# EAGLE design FLEXQCMV1.5 (EAGLE 7.2.0)
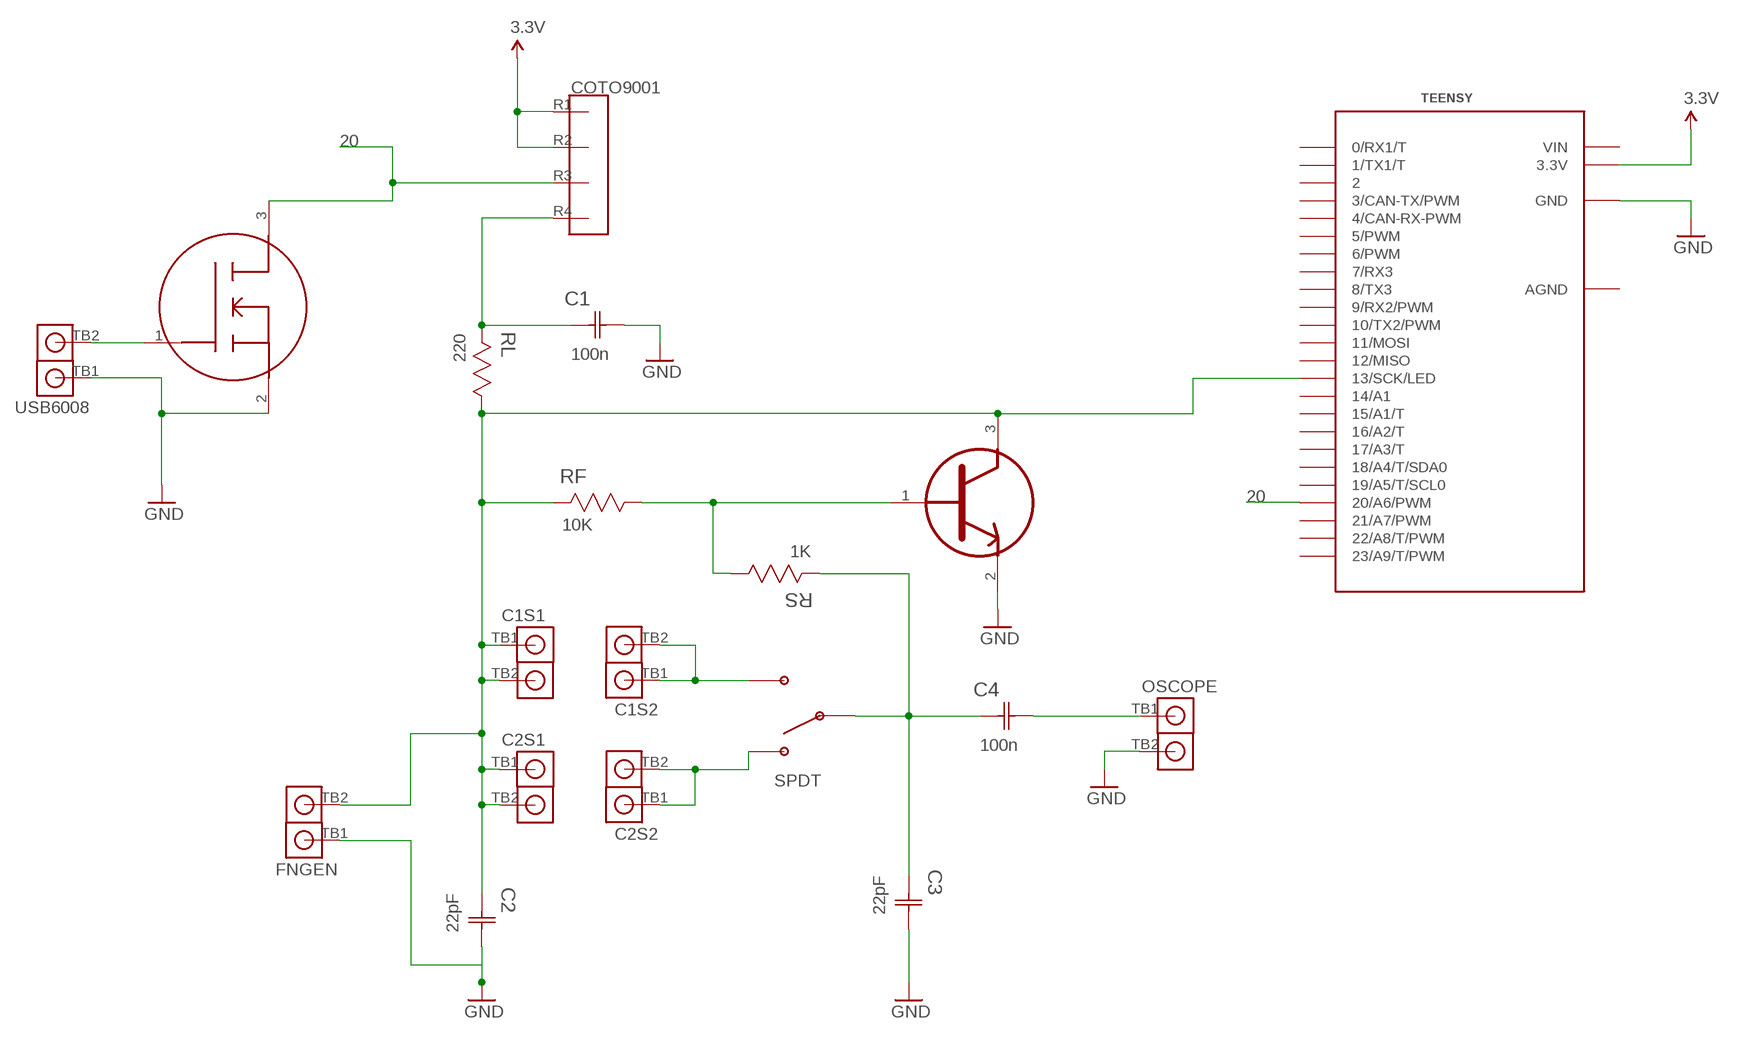
[diagram p0: schematic, sheet 1]

## Parts
C1  100n  C1206C104K1RACTU  [CAPC3216X88N]
C1S1  TERMBLOCKX2  [TERMBLOCKX2]
C1S2  TERMBLOCKX2  [TERMBLOCKX2]
C2  22pF  C1206C220J5GACTU  [CAPC3216X88N]
C2S1  TERMBLOCKX2  [TERMBLOCKX2]
C2S2  TERMBLOCKX2  [TERMBLOCKX2]
C3  22pF  C1206C220J5GACTU  [CAPC3216X88N]
C4  100n  C1206C104K1RACTU  [CAPC3216X88N]
COTO9001  COTO9001  [COTO9001]
FNGEN  TERMBLOCKX2  [TERMBLOCKX2]
OSCOPE  TERMBLOCKX2  [TERMBLOCKX2]
RF  10K  CRCW120610K0FKEA  [RESC3216X71N]
RL  220  CRCW1206220RJNEA  [RESC3216X71N]
RS  1K  CRCW12061K00FKEA  [RESC3216X71N]
SPDT  SPDTSWITCH  [SPDTSWITCH]
TEENSY  TEENSY_3.1_DIL  [TEENSY3-DIL]
U1  FET  2N7002K  [SOT95P230X110-3N]
U2  BJT  BC847C  [SOT95P230X110-3N]
USB6008  TERMBLOCKX2  [TERMBLOCKX2]

## Nets
3.3V: COTO9001.R1 COTO9001.R2 TEENSY.3.3V
20: COTO9001.R3 TEENSY.20/A6(20/A6/PWM) U1.3(D)
GND: C1.2(C2) C2.2(C2) C3.2(C2) FNGEN.TB1 OSCOPE.TB2 TEENSY.GND U1.2(S) U2.2(E) USB6008.TB1
N$1: U1.1(G) USB6008.TB2
N$2: C1.1(C1) COTO9001.R4 RL.2
N$3: C1S1.TB1 C1S1.TB2 C2.1(C1) C2S1.TB1 C2S1.TB2 FNGEN.TB2 RF.2 RL.1 TEENSY.13(13/SCK/LED) U2.3(C)
N$6: RF.1 RS.1 U2.1(B)
N$7: C1S2.TB1 C1S2.TB2 SPDT.SW3
N$8: C2S2.TB1 C2S2.TB2 SPDT.SW1
N$9: C3.1(C1) C4.1(C1) RS.2 SPDT.SW2
N$10: C4.2(C2) OSCOPE.TB1
Unconnected: TEENSY.0(0/RX1/T) TEENSY.1(1/TX1/T) TEENSY.2 TEENSY.3(3/CAN-TX/PWM) TEENSY.4(4/CAN-RX-PWM) TEENSY.5(5/PWM) TEENSY.6(6/PWM) TEENSY.7(7/RX3) TEENSY.8(8/TX3) TEENSY.9(9/RX2/PWM) TEENSY.10(10/TX2/PWM) TEENSY.11(11/MOSI) TEENSY.12(12/MISO) TEENSY.14/A0(14/A1) TEENSY.15/A1(15/A1/T) TEENSY.16/A2(16/A2/T) TEENSY.17/A3(17/A3/T) TEENSY.18/A4(18/A4/T/SDA0) TEENSY.19/A5(19/A5/T/SCL0) TEENSY.21/A7(21/A7/PWM) TEENSY.22/A8(22/A8/T/PWM) TEENSY.23/A9(23/A9/T/PWM)

## Power pins joined to a net without a drawn wire
AGND: TEENSY.AGND
VIN: TEENSY.VIN

## Library data of the parts
C1 C4 = Kemet_By_element14_Batch_1:C1206C104K1RACTU: CAPACITOR, 1206; MPN: C1206C104K1RACTU; OC_FARNELL: 1414714; OC_NEWARK: 85C2205; SUPPLIER: Kemet; TOLERANCE: ±10%; VALUE: 100nF; VOLTAGERATING: 100V
C1S1 C1S2 C2S1 C2S2 FNGEN OSCOPE USB6008 = FLEXQCMLIBRARY:TERMBLOCKX2
C2 C3 = Kemet_By_element14_Batch_1:C1206C220J5GACTU: CAPACITOR, 1206; MPN: C1206C220J5GACTU; OC_FARNELL: 1414717; OC_NEWARK: 70K9304; SUPPLIER: Kemet; TOLERANCE: ±5%; VOLTAGERATING: 50V
COTO9001 = FLEXQCMLIBRARY:COTO9001
RF = Vishay_By_element14_Batch_1:CRCW120610K0FKEA: RESISTOR, 1206; MPN: CRCW120610K0FKEA; OC_FARNELL: 1469970; OC_NEWARK: 53K1907; SUPPLIER: Vishay; TOLERANCE: ±1%; VALUE: 10K Ohms; WATTAGE: 0.25W
RL = Vishay_By_element14_Batch_1:CRCW1206220RJNEA: RESISTOR, 1206; MPN: CRCW1206220RJNEA; OC_FARNELL: -; OC_NEWARK: 59M6970; SUPPLIER: Vishay; TOLERANCE: ±5%; VALUE: 220 Ohms; WATTAGE: 0.25W
RS = Vishay_By_element14_Batch_1:CRCW12061K00FKEA: RESISTOR, 1206; MPN: CRCW12061K00FKEA; OC_FARNELL: 1469965; OC_NEWARK: 53K1780; SUPPLIER: Vishay; TOLERANCE: ±1%; VALUE: 1K Ohms; WATTAGE: 0.25W
SPDT = FLEXQCMLIBRARY:SPDTSWITCH
TEENSY = Teensy_3_and_LC_Series_Boards_v1.0:TEENSY_3.1_DIL: Teensy 3.1 or 3.2 in a DIL Layout.
U1 = NXP_By_element14_Batch_1:2N7002K: logic level FET; MPN: 2N7002K; OC_FARNELL: 1758065; OC_NEWARK: -; PACKAGE: SOT-3; SUPPLIER: NXP Semiconductors
U2 = NXP_By_element14_Batch_1:BC847C

## Board
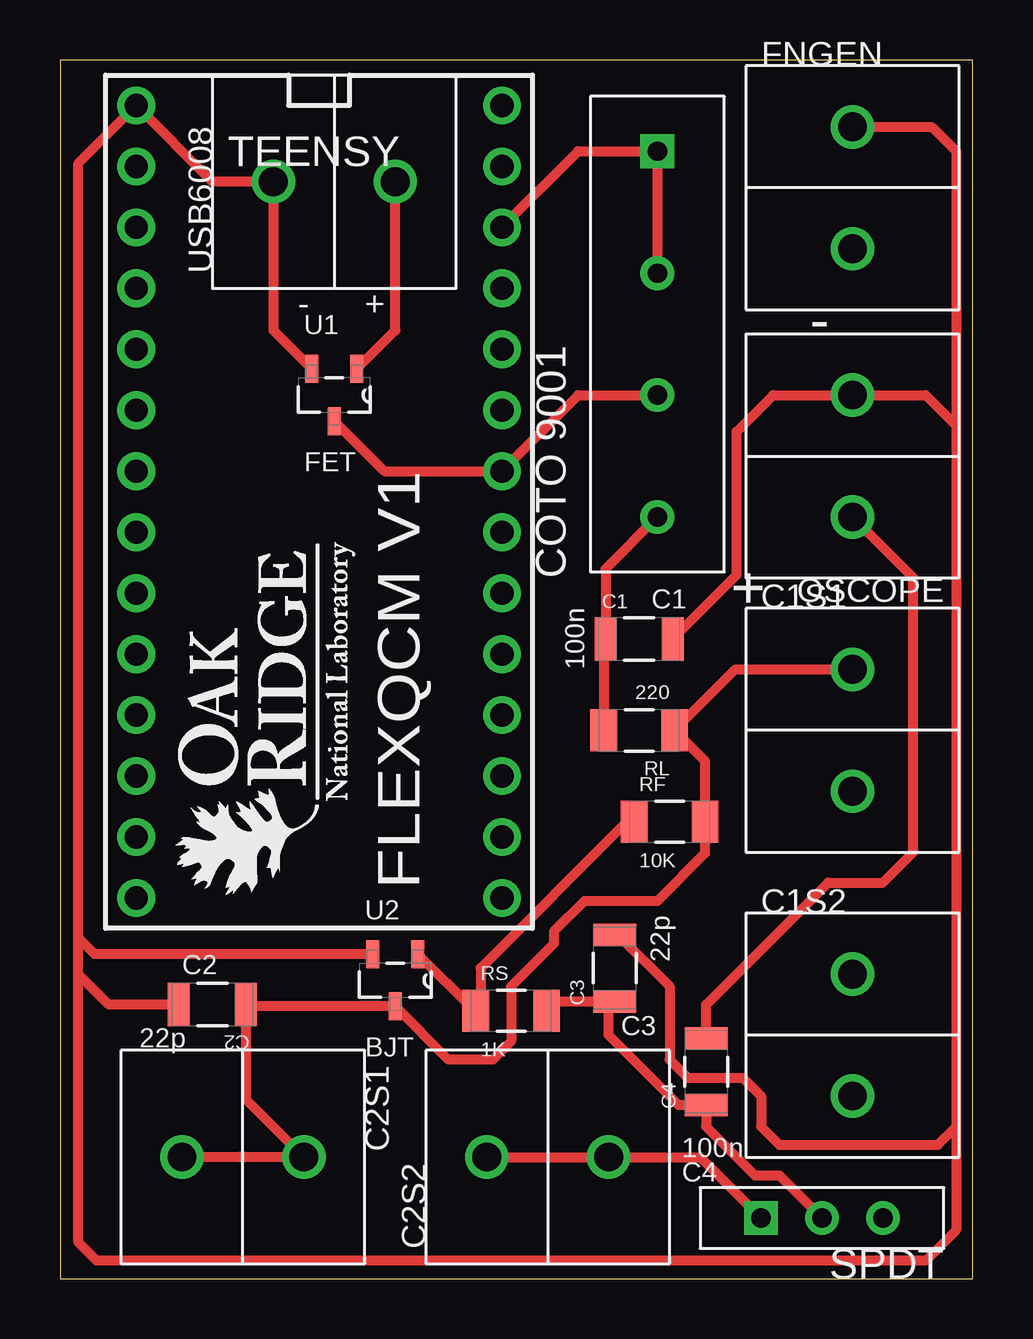
[diagram p1: board, top side]
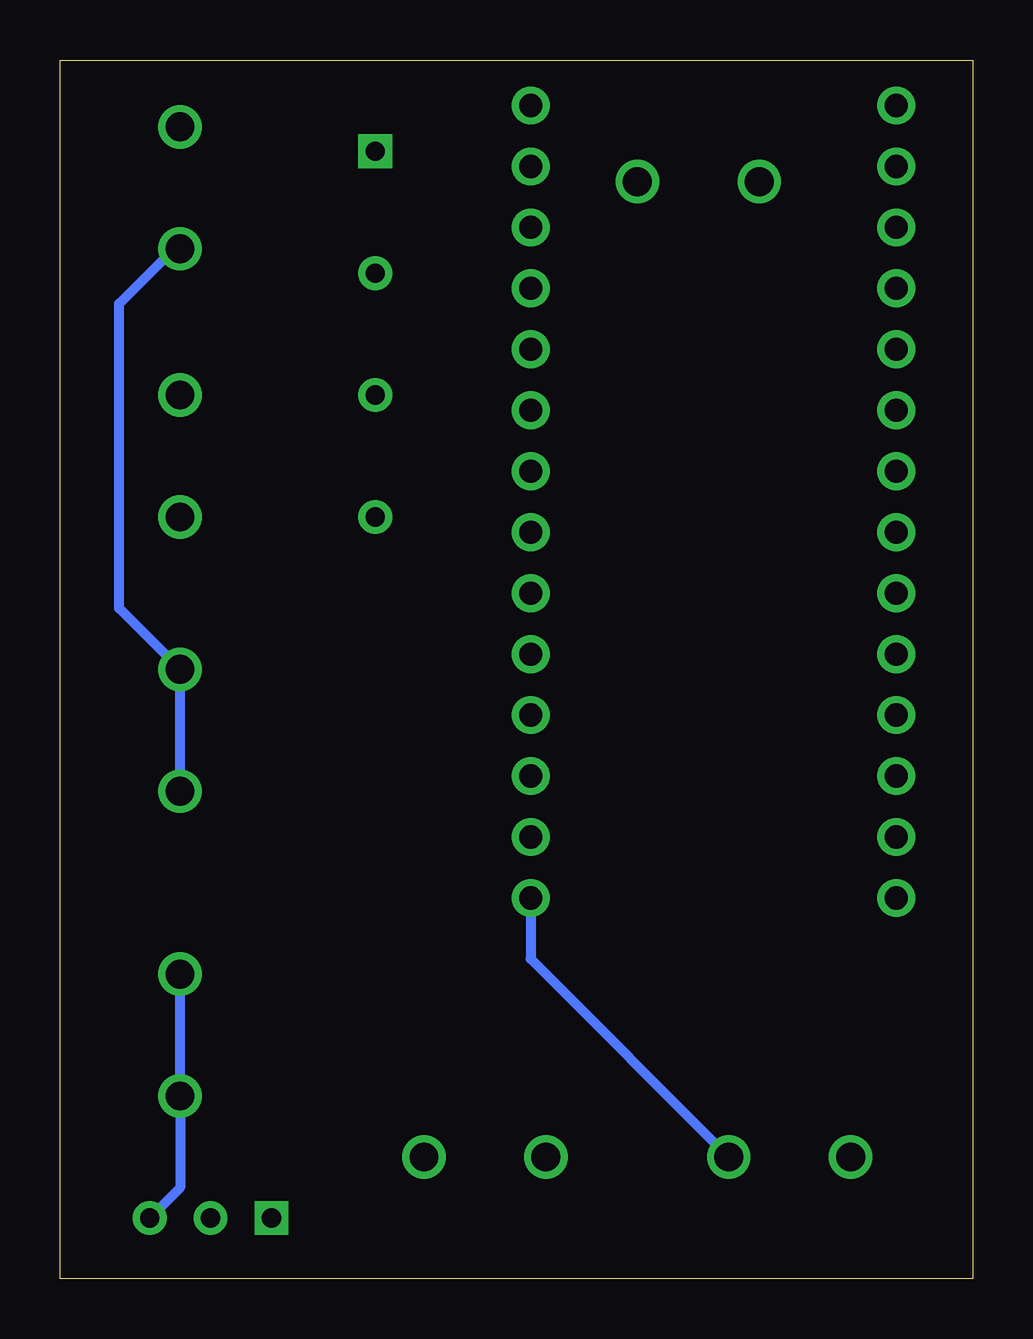
[diagram p2: board, bottom side, seen from below]

Size 38.02 x 50.79 mm. Coordinates in mm from the lower left corner, seen from the top.
Outline: 0,0 38.02,0 38.02,50.79 0,50.79 0,0
Copper layers (1*16): Top 0.035mm / dielectric 1.5mm / Bottom 0.035mm
Design rules "SparkFun": minimum track width 8mil, minimum drill 20mil, track to track 8mil, track to pad 8mil, pad to pad 8mil, via to via 8mil, smd to smd 8mil, copper to edge 10mil, drill to drill 8mil, minimum pad ring 12mil, minimum via ring 10mil, stop-mask expansion 4mil, vias tented up to drill 25mil, thermal gap 10mil

### Footprints (pad centres in the part's own frame; a part is rotated, then mirrored left to right if it is on the bottom)
CAPC3216X88N = smd 0.914 x 1.803: 1 -1.397,0; 2 1.397,0
TERMBLOCKX2 = drill 1.2: TB1 0,2.54; TB2 0,-2.54
COTO9001 = drill 0.8 square: R1 0,7.62 | drill 0.8: R2 0,2.54; R3 0,-2.54; R4 0,-7.62
RESC3216X71N = smd 1.118 x 1.753: 1 -1.473,0; 2 1.473,0
SPDTSWITCH = drill 0.8 square: SW1 0,2.54 | drill 0.8: SW2 0,0; SW3 0,-2.54
TEENSY3-DIL = drill 0.965: 0 -7.62,13.97; 1 -7.62,11.43; 2 -7.62,8.89; 3 -7.62,6.35; 3.3V 7.62,11.43; 4 -7.62,3.81; 5 -7.62,1.27; 6 -7.62,-1.27; 7 -7.62,-3.81; 8 -7.62,-6.35; 9 -7.62,-8.89; 10 -7.62,-11.43; 11 -7.62,-13.97; 12 -7.62,-16.51; 13 7.62,-16.51; 14/A0 7.62,-13.97; 15/A1 7.62,-11.43; 16/A2 7.62,-8.89; 17/A3 7.62,-6.35; 18/A4 7.62,-3.81; 19/A5 7.62,-1.27; 20/A6 7.62,1.27; 21/A7 7.62,3.81; 22/A8 7.62,6.35; 23/A9 7.62,8.89; AGND 7.62,13.97; GND -7.62,16.51; VIN 7.62,16.51
SOT95P230X110-3N = smd 1.168 x 0.533: 1 -1.092,0.94; 2 -1.092,-0.94; 3 1.092,0

### Placement (x,y rotation side)
C1  24.13,26.67 0 top
C1S1  33.02,22.86 0 top
C1S2  33.02,10.16 0 top
C2  6.35,11.43 180 top
C2S1  7.62,5.08 270 top
C2S2  20.32,5.08 90 top
C3  23.11,12.95 90 top
C4  26.92,8.64 90 top
COTO9001  24.89,39.37 0 top
FNGEN  33.02,45.47 0 top
OSCOPE  33.02,34.29 180 top
RF  25.4,19.05 0 top
RL  24.13,22.86 180 top
RS  18.8,11.18 0 top
SPDT  31.75,2.54 90 top
TEENSY  10.79,32.38 0 top
U1  11.43,36.83 270 top
U2  13.97,12.45 270 top
U$1  [ORNLLOGOV9]  12.45,15.75 90 top
USB6008  11.43,45.72 90 top

### Tracks (layer width: path | path; a pad name or v marks a point on that pad's centre or on a via)
3.3V
  Top 0.406: TEENSY.3.3V 21.59,46.99 COTO9001.R1 COTO9001.R2
20
  Top 0.406: U1.3 13.51,33.66 TEENSY.20/A6 21.59,36.83 COTO9001.R3
GND
  Top 0.406: U1.2 8.89,39.52 USB6008.TB1 6.35,45.72 TEENSY.GND 0.76,46.48 0.76,14.22 | 37.34,35.56 36.07,36.83 OSCOPE.TB2 29.72,36.83 28.19,35.31 28.19,29.34 C1.2 | 37.34,35.56 37.34,6.35 | 37.34,6.35 37.34,2.03 36.07,0.76 1.52,0.76 0.76,1.52 0.76,12.7 | 0.76,12.7 0.76,14.22 | FNGEN.TB1 36.32,48.01 37.34,46.99 37.34,35.56 | C2.2 2.03,11.43 0.76,12.7 | U2.2 1.45,13.54 0.76,14.22 | C3.2 23.24,14.35 25.4,12.19 25.4,9.14 26.16,8.38 28.45,8.38 29.21,7.62 29.21,6.35 29.97,5.59 36.58,5.59 37.34,6.35
N$1
  Top 0.406: U1.1 13.97,39.52 USB6008.TB2
N$2
  Top 0.406: COTO9001.R4 22.73,29.59 C1.1 22.66,26.59 RL.2
N$3
  Top 0.406: C1S1.TB1 28.14,25.4 RL.1 26.87,21.59 RF.2 26.87,17.73 24.89,15.75 21.84,15.75 20.57,14.48 20.57,13.97 18.8,12.19 18.8,9.91 18.03,9.14 16.18,9.14 U2.3 7.82,11.35 C2.1 7.75,7.49 C2S1.TB1 C2S1.TB2
  Bottom 0.406: C1S1.TB2 C1S1.TB1 35.56,27.94 35.56,40.64 33.27,42.93 FNGEN.TB2 | TEENSY.13 18.41,13.34 C2S1.TB1
N$6
  Top 0.406: RF.1 23.62,19.05 17.53,12.95 17.53,11.38 RS.1 17.27,11.18 U2.1
N$7
  Bottom 0.406: C1S2.TB1 C1S2.TB2 33.02,3.81 SPDT.SW3
N$8
  Top 0.406: C2S2.TB1 C2S2.TB2 26.67,5.08 SPDT.SW1
N$9
  Top 0.406: RS.2 20.65,11.56 C3.1 22.86,11.3 22.86,10.16 25.78,7.24 C4.1 26.92,6.35 28.96,4.32 29.97,4.32 SPDT.SW2
N$10
  Top 0.406: C4.2 26.92,11.43 32,16.51 34.29,16.51 35.56,17.78 35.56,29.21 OSCOPE.TB1

### Text on the board
tPlace: - | + | - | C1 | + | 100n | FLEXQCM V1 | C2 | 22p | 22p | C3 | 100n | C4